# Altium schematic sheet grouping.SchDoc
size 209 x 297 mm; PageSetup: Record=PageOptions|CenterHorizontal=False|CenterVertical=False|PrintScale=1.00|XCorrection=0.00|YCorrection=0.00|PrintKind=0|BorderSize=5000000|LeftOffset=0|BottomOffset=0|Orientation=2|PaperLength=1000|PaperWidth=1000|Scale=100|PaperSource=15|PrintQuality=-3|MediaType=1|DitherType=10|PrintScaleMode=0|PaperKind=A3|PaperIndex=8; TitleBlock_02_DocumentDesignator: BCAD.123456.001 Э3; TitleBlock_07_SheetNumber: 3
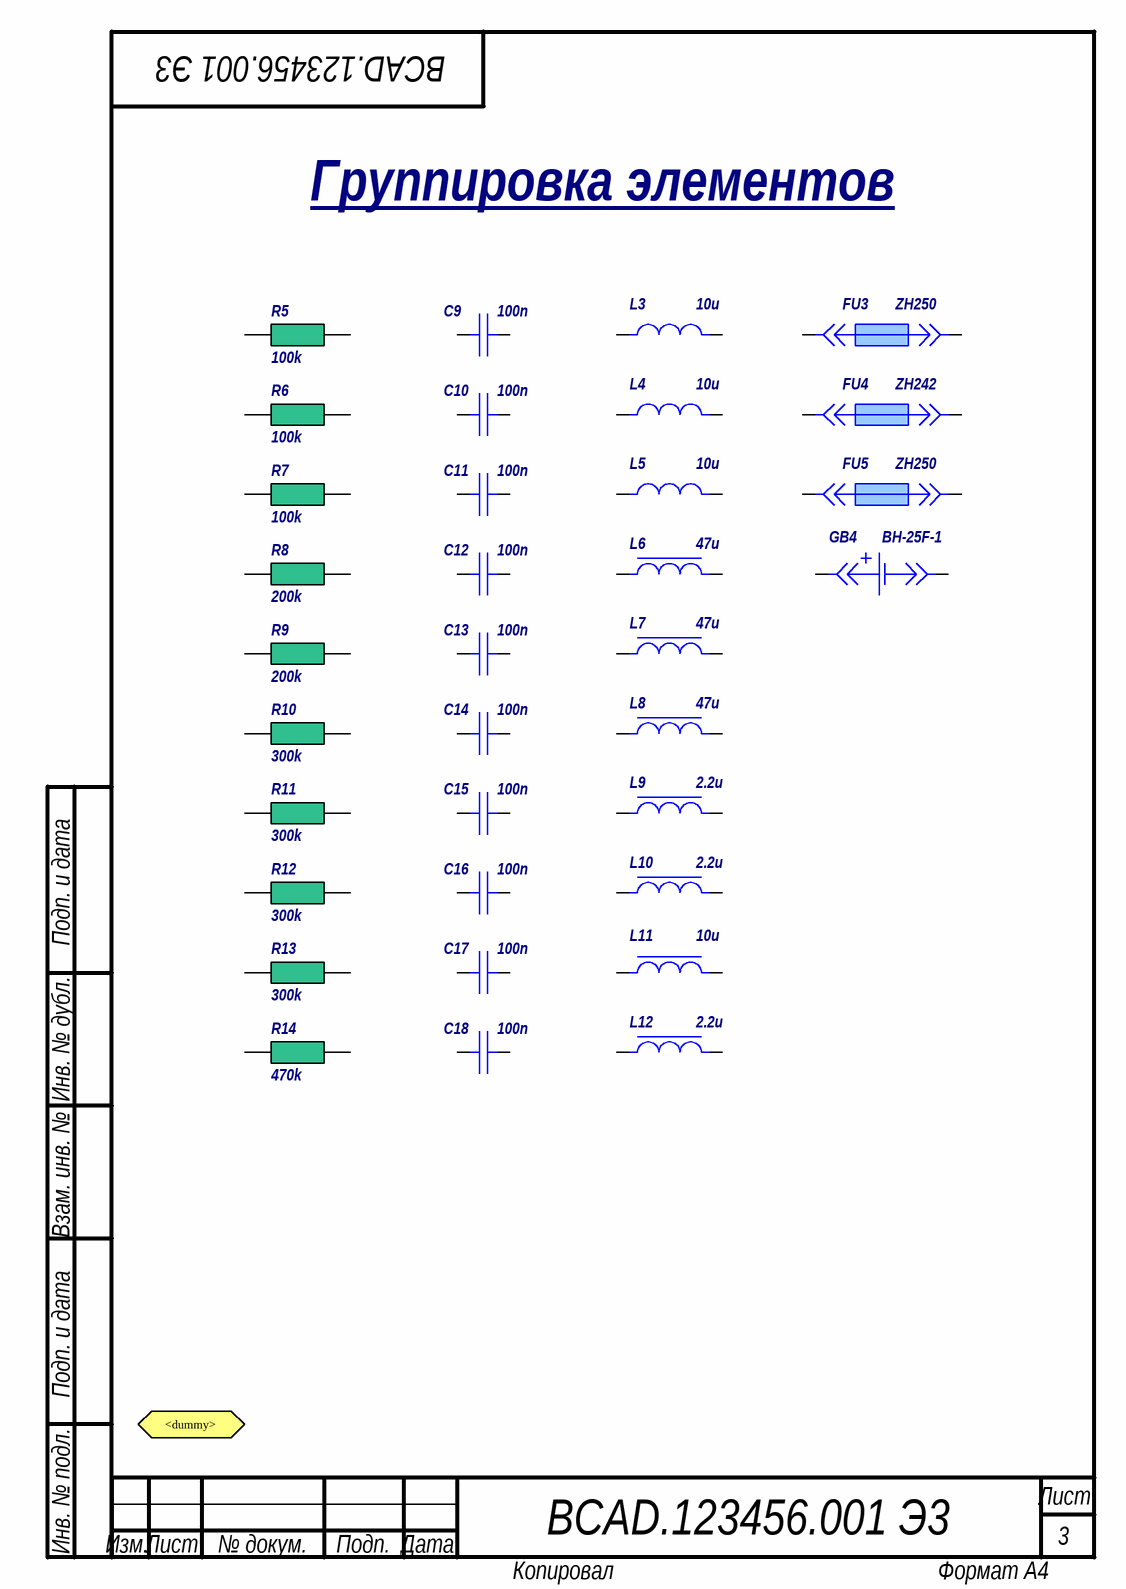
[diagram p0: grouping.SchDoc]

## Parts
C9  100n  [MLCC_0603]
C10  100n  [MLCC_0603]
C11  100n  [MLCC_0603]
C12  100n  [MLCC_0603]
C13  100n  [MLCC_0603]
C14  100n  [MLCC_0603]
C15  100n  [MLCC_0603]
C16  100n  [MLCC_0603]
C17  100n  [MLCC_0603]
C18  100n  [MLCC_0603]
FU3  ZH250  [ZH250]
FU4  ZH242  [ZH242]
FU5  ZH250  [ZH250]
GB4  BH-25F-1  [BH-25F-1]
L3  10u  [LC_1812-3.20]
L4  10u  [LC_1812-3.20]
L5  10u  [LC_1812-3.20]
L6  47u  [SRU1048]
L7  47u  [SRU1048]
L8  47u  [SRU1048]
L9  2.2u  [SRN6045TA]
L10  2.2u  [SRN6045TA]
L11  10u  [SRR0604]
L12  2.2u  [SRN6045TA]
R5  100k  [RC_0603]
R6  100k  [RC_0603]
R7  100k  [RC_0603]
R8  200k  [RC_0603]
R9  200k  [RC_0603]
R10  300k  [RC_0603]
R11  300k  [RC_0603]
R12  300k  [RC_0603]
R13  300k  [RC_0603]
R14  470k  [RC_0603]

## Ports
<dummy>

## Nets

Not connected (* = marked no-connect by the designer): C9 1 2; C10 1 2; C11 1 2; C12 1 2; C13 1 2; C14 1 2; C15 1 2; C16 1 2; C17 1 2; C18 1 2; FU3 1 2; FU4 1 2; FU5 1 2; GB4 A C; L3 1 2; L4 1 2; L5 1 2; L6 1 2; L7 1 2; L8 1 2; L9 1 2; L10 1 2; L11 1 2; L12 1 2; R5 1 2; R6 1 2; R7 1 2; R8 1 2; R9 1 2; R10 1 2; R11 1 2; R12 1 2; R13 1 2; R14 1 2

## Notes on the sheet
- Группировка элементов
- Подп. и дата
- Инв. № дубл.
- Взам. инв. №
- Инв. № подл.
- Изм.
- Лист
- № докум.
- Подп.
- Дата
- Копировал
- Формат А4

## Library data of the parts
C9-C18 = Capacitor nonpolar: Nonpolar capacitor, generic; BOM_manufacturer: YAGEO; BOM_value: CC0603KRX7R9BB104; BOM_type: Конденсатор; BOM_description: керам., чип 0603, X7R, 0.1мкФ ±10%, 50В; BOM_explicit: false; SCH_value: 100n
FU3 = Fuse holder: BOM_type: Предохранитель; BOM_description: держатель; BOM_explicit: true; BOM_accessory: Предохранитель: 0215002.MXP @ Littlefuse (плавкий, цил. 5*20, 2А, 250В, 11.680А²с, медленный) #1; BOM_value: ZH250; SCH_value: ZH250
FU4 = Fuse holder: BOM_type: Предохранитель; BOM_description: держатель; BOM_explicit: true; BOM_accessory: Предохранитель: 520.517 @ ESKA Erich Schweizer (плавкий, цил. 5*20, 1А, 250В, 0.2А²с, быстрый) #2 *один запасной; BOM_value: ZH242; SCH_value: ZH242
FU5 = Fuse holder: BOM_type: Предохранитель; BOM_description: держатель; BOM_explicit: true; BOM_accessory: Предохранитель: 520.517 @ ESKA Erich Schweizer (плавкий, цил. 5*20, 1А, 250В, 0.2А²с, быстрый) #1; BOM_value: ZH250; SCH_value: ZH250
GB4 = Cell holder: Battery holder, single cell, generic; BOM_manufacturer: Adam Tech; BOM_type: Элемент гальванический; BOM_description: держатель, CR2032; BOM_substitute: DS1092-04-B6P@Connfly;BS-7@Memory Protection Devices; BOM_explicit: true; BOM_accessory: Элемент гальванический: CR2032 (3В, 225мАч); BOM_value: BH-25F-1; SCH_value: BH-25F-1
L3-L5 = Inductor: BOM_value: NL453232T-100K; BOM_type: Индуктивность; BOM_description: чип 1812, 10мкГн ±10%, 250мА; BOM_explicit: false; SCH_value: 10u
L6-L8 = Choke: BOM_manufacturer: Bourns; BOM_value: SRU1048-470Y; BOM_type: Дроссель; BOM_description: 47мкГн ±30%, 1.5А; BOM_explicit: true; SCH_value: 47u
L9 L10 L12 = Choke: BOM_manufacturer: Bourns; BOM_value: SRN6045TA-2R2Y; BOM_type: Дроссель; BOM_description: 2.2мкГн ±30%, 6А; BOM_explicit: true; SCH_value: 2.2u
L11 = Choke: BOM_manufacturer: Bourns; BOM_value: SRR0604-100ML; BOM_type: Дроссель; BOM_description: 10мкГн ±20%, 1.3А; BOM_explicit: true; SCH_value: 10u
R5-R7 = Resistor: Fixed-value resistor, generic; BOM_manufacturer: YAGEO; BOM_value: RC0603JR-07100KL; BOM_type: Резистор; BOM_description: чип 0603, 100кОм ±5%; BOM_explicit: false; SCH_value: 100k
R8 R9 = Resistor: Fixed-value resistor, generic; BOM_manufacturer: YAGEO; BOM_value: RC0603JR-07200KL; BOM_type: Резистор; BOM_description: чип 0603, 200кОм ±5%; BOM_explicit: false; SCH_value: 200k
R10-R13 = Resistor: Fixed-value resistor, generic; BOM_manufacturer: YAGEO; BOM_value: RC0603JR-07300KL; BOM_type: Резистор; BOM_description: чип 0603, 300кОм ±5%; BOM_explicit: false; SCH_value: 300k
R14 = Resistor: Fixed-value resistor, generic; BOM_manufacturer: YAGEO; BOM_value: RC0603JR-07470KL; BOM_type: Резистор; BOM_description: чип 0603, 470кОм ±5%; BOM_explicit: false; SCH_value: 470k